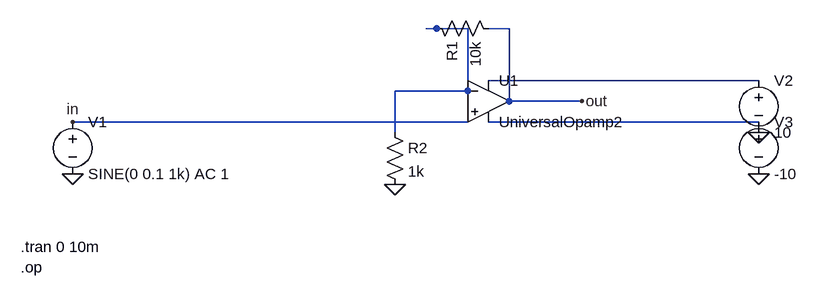
[diagram p0: schematic non_inverting_opamp_spec.asc]
non_inverting_opamp_spec.asc, the LTspice schematic file:
Version 4
SHEET 1 2000 1300
WIRE 128 320 736 320
WIRE 736 320 736 304
WIRE 736 272 624 272
WIRE 624 272 624 336
WIRE 736 272 736 176
WIRE 736 176 672 176
WIRE 800 288 800 176
WIRE 800 176 768 176
WIRE 1184 256 768 256
WIRE 1184 320 768 320
WIRE 800 288 912 288
FLAG 128 320 in
FLAG 912 288 out
FLAG 128 400 0
FLAG 624 416 0
FLAG 1184 336 0
FLAG 1184 400 0
SYMBOL voltage 128 304 R0
SYMATTR InstName V1
SYMATTR Value SINE(0 0.1 1k) AC 1
SYMBOL UniversalOpAmp2 768 288 R0
SYMATTR InstName U1
SYMATTR Value UniversalOpamp2
SYMBOL res 608 320 R0
SYMATTR InstName R2
SYMATTR Value 1k
SYMBOL res 672 160 M90
SYMATTR InstName R1
SYMATTR Value 10k
SYMBOL voltage 1184 240 R0
SYMATTR InstName V2
SYMATTR Value 10
SYMBOL voltage 1184 304 R0
SYMATTR InstName V3
SYMATTR Value -10
TEXT 48 512 Left 2 !.tran 0 10m
TEXT 48 544 Left 2 !.op

The netlist it stands for:
* non_inverting_opamp_spec.asc
V1 in 0 SINE(0 0.1 1k) AC 1
XU1 in N001 N002 N003 out level2 UniversalOpamp2 Avol=1Meg GBW=10Meg Slew=10Meg Ilimit=25m Rail=0 Vos=0 En=0 Enk=0 In=0 Ink=0 Rin=500Meg  ; pins In+ In- V+ V- OUT
R2 N001 0 1k
R1 N001 out 10k
V2 N002 0 10
V3 N003 0 -10
.tran 0 10m
.op
.lib UniversalOpAmp2.lib
.backanno
.end